# EAGLE design SPEAR Speedy (EAGLE 9.5.1)
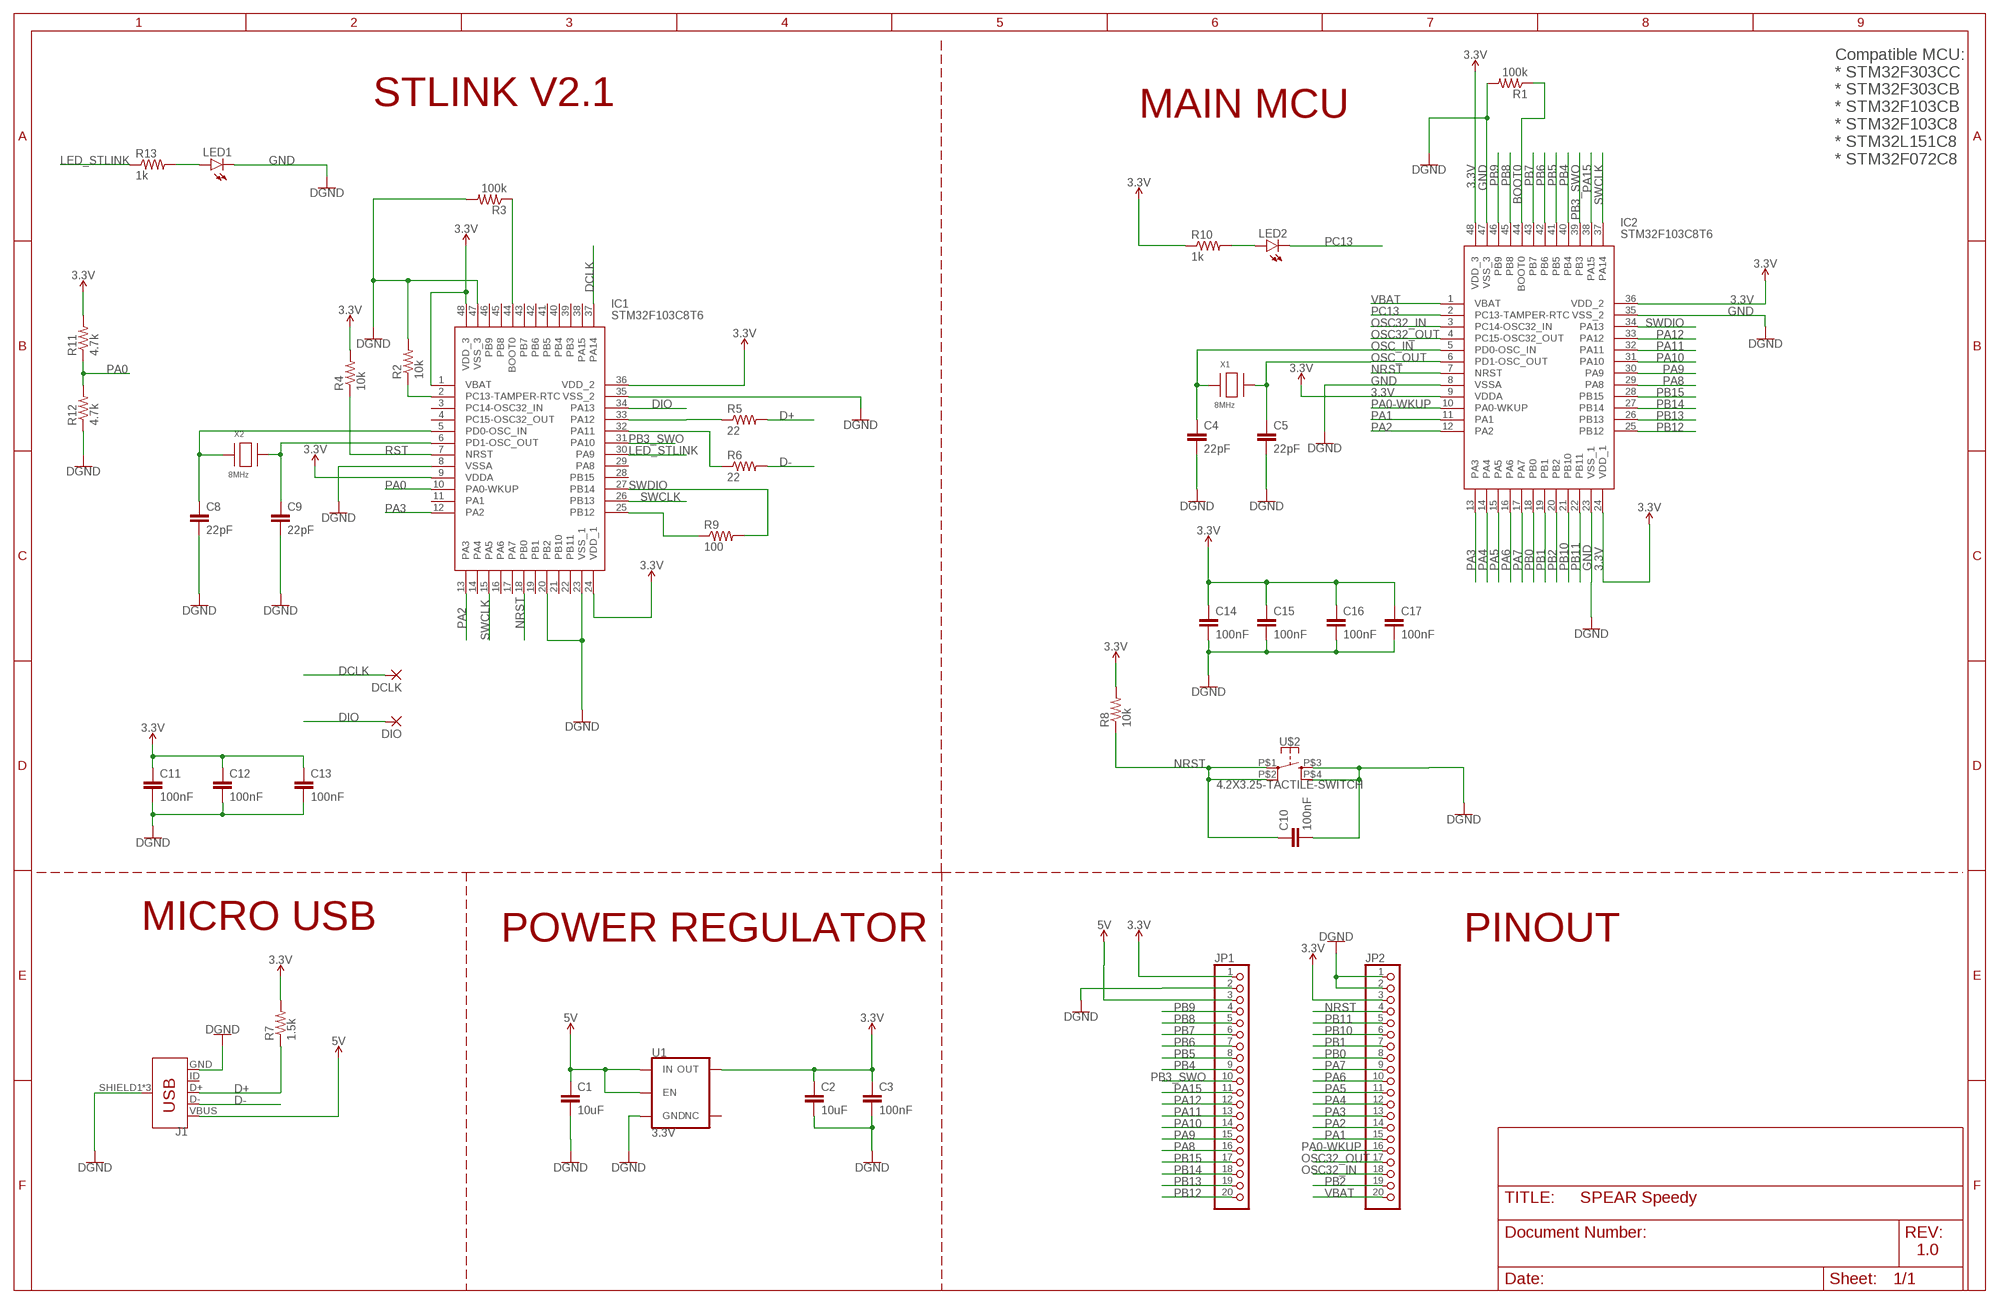
[diagram p0: schematic, sheet 1]

## Parts
C1  10uF  C-EUC0805  [C0805]
C2  10uF  C-EUC0805  [C0805]
C3  100nF  C-EUC0603  [C0603]
C4  22pF  C-EUC0603  [C0603]
C5  22pF  C-EUC0603  [C0603]
C8  22pF  C-EUC0603  [C0603]
C9  22pF  C-EUC0603  [C0603]
C10  100nF  C-EUC0603  [C0603]
C11  100nF  C-EUC0603  [C0603]
C12  100nF  C-EUC0603  [C0603]
C13  100nF  C-EUC0603  [C0603]
C14  100nF  C-EUC0603  [C0603]
C15  100nF  C-EUC0603  [C0603]
C16  100nF  C-EUC0603  [C0603]
C17  100nF  C-EUC0603  [C0603]
DCLK  SMD2  [SMD1,27-2,54]
DIO  SMD2  [SMD1,27-2,54]
IC1  STM32F103C8T6  [QFP50P900X900X160-48N]
IC2  STM32F103C8T6  [QFP50P900X900X160-48N]
J1  USB_MICRO-B_FEMALE-SMT  [USB-B-MICRO-SMD]
JP1  PINHD-1X20  [1X20]
JP2  PINHD-1X20  [1X20]
LED1  LEDCHIP-LED0805  [CHIP-LED0805]
LED2  LEDCHIP-LED0805  [CHIP-LED0805]
R1  100k  R-US_R0603  [R0603]
R2  10k  R-US_R0603  [R0603]
R3  100k  R-US_R0603  [R0603]
R4  10k  R-US_R0603  [R0603]
R5  22  R-US_R0603  [R0603]
R6  22  R-US_R0603  [R0603]
R7  1.5k  R-US_R0603  [R0603]
R8  10k  R-US_R0603  [R0603]
R9  100  R-US_R0603  [R0603]
R10  1k  R-US_R0603  [R0603]
R11  4.7k  R-US_R0603  [R0603]
R12  4.7k  R-US_R0603  [R0603]
R13  1k  R-US_R0603  [R0603]
U1  3.3V  V_REG_AP2112K-3.3V  [SOT23-5]
U$2  4.2X3.25-TACTILE-SWITCH  [4.2X3.25]
X1  8MHz  XTALNX5032  [NX5032]
X2  8MHz  XTALNX5032  [NX5032]

## Nets
3.3V: C2.1 C3.1 C11.1 C12.1 C13.1 C14.1 C15.1 C16.1 C17.1 IC1.1(VBAT) IC1.9(VDDA) IC1.24(VDD_1) IC1.36(VDD_2) IC1.48(VDD_3) IC2.9(VDDA) IC2.24(VDD_1) IC2.36(VDD_2) IC2.48(VDD_3) JP1.1 JP2.3 R4.2 R7.2 R8.2 R10.1 R11.2 U1.5(OUT)
5V: C1.1 J1.VBUS JP1.3 U1.1(IN) U1.3(EN)
BOOT0: IC2.44(BOOT0) R1.1
D+: J1.D+ R5.2 R7.1
D-: J1.D- R6.2
DCLK: DCLK.1(P) IC1.37(PA14)
DIO: DIO.1(P) IC1.34(PA13)
GND: C1.2 C2.2 C3.2 C4.2 C5.2 C8.2 C9.2 C10.2 C11.2 C12.2 C13.2 C14.2 C15.2 C16.2 C17.2 IC1.8(VSSA) IC1.20(PB2) IC1.23(VSS_1) IC1.35(VSS_2) IC1.47(VSS_3) IC2.8(VSSA) IC2.23(VSS_1) IC2.35(VSS_2) IC2.47(VSS_3) J1.GND J1.SHIELD1(SHIELD) J1.SHIELD2(SHIELD) J1.SHIELD3(SHIELD) JP1.2 JP2.1 JP2.2 LED1.C R1.2 R2.2 R3.2 R12.1 U1.2(GND) U$2.P$3 U$2.P$4 ; supply symbol labelled DGND
LED_STLINK: IC1.30(PA9) R13.1
N$1: IC1.33(PA12) R5.1
N$2: IC1.32(PA11) R6.1
N$3: IC1.44(BOOT0) R3.1
N$4: C8.1 IC1.5(PD0-OSC_IN) X2.P$1
N$5: IC1.2(PC13-TAMPER-RTC) R2.1
N$6: C9.1 IC1.6(PD1-OSC_OUT) X2.P$2
N$7: LED1.A R13.2
N$8: IC1.25(PB12) R9.1
N$9: LED2.A R10.2
NRST: C10.1 IC1.18(PB0) IC2.7(NRST) JP2.4 R8.1 U$2.P$1 U$2.P$2
OSC32_IN: IC2.3(PC14-OSC32_IN) JP2.18
OSC32_OUT: IC2.4(PC15-OSC32_OUT) JP2.17
OSC_IN: C4.1 IC2.5(PD0-OSC_IN) X1.P$1
OSC_OUT: C5.1 IC2.6(PD1-OSC_OUT) X1.P$2
PA0: IC1.10(PA0-WKUP) R11.1 R12.2
PA0-WKUP: IC2.10(PA0-WKUP) JP2.16
PA1: IC2.11(PA1) JP2.15
PA2: IC1.13(PA3) IC2.12(PA2) JP2.14
PA3: IC1.12(PA2) IC2.13(PA3) JP2.13
PA4: IC2.14(PA4) JP2.12
PA5: IC2.15(PA5) JP2.11
PA6: IC2.16(PA6) JP2.10
PA7: IC2.17(PA7) JP2.9
PA8: IC2.29(PA8) JP1.16
PA9: IC2.30(PA9) JP1.15
PA10: IC2.31(PA10) JP1.14
PA11: IC2.32(PA11) JP1.13
PA12: IC2.33(PA12) JP1.12
PA15: IC2.38(PA15) JP1.11
PB0: IC2.18(PB0) JP2.8
PB1: IC2.19(PB1) JP2.7
PB2: IC2.20(PB2) JP2.19
PB3_SWO: IC1.31(PA10) IC2.39(PB3) JP1.10
PB4: IC2.40(PB4) JP1.9
PB5: IC2.41(PB5) JP1.8
PB6: IC2.42(PB6) JP1.7
PB7: IC2.43(PB7) JP1.6
PB8: IC2.45(PB8) JP1.5
PB9: IC2.46(PB9) JP1.4
PB10: IC2.21(PB10) JP2.6
PB11: IC2.22(PB11) JP2.5
PB12: IC2.25(PB12) JP1.20
PB13: IC2.26(PB13) JP1.19
PB14: IC2.27(PB14) JP1.18
PB15: IC2.28(PB15) JP1.17
PC13: IC2.2(PC13-TAMPER-RTC) LED2.C
RST: IC1.7(NRST) R4.1
SWCLK: IC1.15(PA5) IC1.26(PB13) IC2.37(PA14)
SWDIO: IC1.27(PB14) IC2.34(PA13) R9.2
VBAT: IC2.1(VBAT) JP2.20
Unconnected: IC1.3(PC14-OSC32_IN) IC1.4(PC15-OSC32_OUT) IC1.11(PA1) IC1.14(PA4) IC1.16(PA6) IC1.17(PA7) IC1.19(PB1) IC1.21(PB10) IC1.22(PB11) IC1.28(PB15) IC1.29(PA8) IC1.38(PA15) IC1.39(PB3) IC1.40(PB4) IC1.41(PB5) IC1.42(PB6) IC1.43(PB7) IC1.45(PB8) IC1.46(PB9) J1.ID U1.4(NC)

## Notes on the sheet
- STLINK V2.1 | MAIN MCU
- Compatible MCU:
  * STM32F303CC
  * STM32F303CB
  * STM32F103CB
  * STM32F103C8
  * STM32L151C8
  * STM32F072C8
- MICRO USB | POWER REGULATOR | PINOUT
- 1.0

## Library data of the parts
C1-C3 C10-C17 = rcl:C-EU: CAPACITOR, European symbol; SPICEPREFIX: C
C4 C5 C8 C9 = resistor:C-EU: CAPACITOR, European symbol
DCLK DIO = wirepad:SMD2: SMD PAD
IC1 IC2 = LCSC:STM32F103C8T6: STM32F103C8T6, 32 bit ARM Cortex M3 Microcontroller 72MHz 64kb Flash, 20kb RAM, USB I2C SPI 48-Pin LQFP Source: Datasheet <http://www.mouser.com/datasheet/2/389/stm32f103c8-956229.pdf>; DESCRIPTION: STM32F103C8T6, 32 bit ARM Cortex M3 Microcontroller 72MHz 64kb Flash, 20kb RAM, USB I2C SPI 48-Pin LQFP; HEIGHT: 1.6mm; MANUFACTURER_NAME: STMicroelectronics; MANUFACTURER_PART_NUMBER: STM32F103C8T6; MOUSER_PART_NUMBER: 511-STM32F103C8T6
J1 = SparkFun-Connectors:USB_MICRO-B: USB Type Micro-B Connector Male/female and PTH/SMT variants SparkFun Products: SparkFun microB USB Breakout <https://www.sparkfun.com/products/12035> SparkFun USB microB Plug Breakout <https://www.sparkfun.com/products/10031> SparkFun ESP8266 Thing <https://www.sparkfun.com/products/13231>; PROD_ID: CONN-11752
JP1 JP2 = pinhead:PINHD-1X20: PIN HEADER
LED1 LED2 = led:LED: LED OSRAM: - CHIPLED LG R971, LG N971, LY N971, LG Q971, LY Q971, LO R971, LY R971 LH N974, LH R974 LS Q976, LO Q976, LY Q976 LO Q996 - Hyper CHIPLED LW Q18S LB Q993, LB Q99A, LB R99A - SideLED LS A670, LO A670, LY A670, LG A670, LP A670 LB A673, LV A673, LT A673, LW A673 LH A674 LY A675 LS A676, LA A676, LO A676, LY A676, LW A676 LS A679, LY A679, LG A679 - Hyper Micro SIDELED® LS Y876, LA Y876, LO Y876, LY Y876 LT Y87S - SmartLED LW L88C, LW L88S LB L89C, LB L89S, LG L890 LS L89K, LO L89K, LY L89K LS L896, LA L896, LO L896, LY L896 - TOPLED LS T670, LO T670, LY T670, LG T670, LP T670 LSG T670, LSP T670, LSY T670, LOP T670, LYG T670 LG T671, LOG T671, LSG T671 LB T673, LV T673, LT T673, LW T673 LH T674 LS T676, LA T676, LO T676, LY T676, LB T676, LH T676, LSB T676, LW T676 LB T67C, LV T67C, LT T67C, LS T67K, LO T67K, LY T67K, LW E67C LS E67B, LA E67B, LO E67B, LY E67B, LB E67C, LV E67C, LT E67C LW T67C LS T679, LY T679, LG T679 LS T770, LO T770, LY T770, LG T770, LP T770 LB T773, LV T773, LT T773, LW T773 LH T774 LS E675, LA E675, LY E675, LS T675 LS T776, LA T776, LO T776, LY T776, LB T776 LHGB T686 LT T68C, LB T68C - Hyper Mini TOPLED® LB M676 - Mini TOPLED Santana® LG M470 LS M47K, LO M47K, LY M47K Source: http://www.osram.convergy.de LUXEON: - LUMILED® LXK2-PW12-R00, LXK2-PW12-S00, LXK2-PW14-U00, LXK2-PW14-V00 LXK2-PM12-R00, LXK2-PM12-S00, LXK2-PM14-U00 LXK2-PE12-Q00, LXK2-PE12-R00, LXK2-PE12-S00, LXK2-PE14-T00, LXK2-PE14-U00 LXK2-PB12-K00, LXK2-PB12-L00, LXK2-PB12-M00, LXK2-PB14-N00, LXK2-PB14-P00, LXK2-PB14-Q00 LXK2-PR12-L00, LXK2-PR12-M00, LXK2-PR14-Q00, LXK2-PR14-R00 LXK2-PD12-Q00, LXK2-PD12-R00, LXK2-PD12-S00 LXK2-PH12-R00, LXK2-PH12-S00 LXK2-PL12-P00, LXK2-PL12-Q00, LXK2-PL12-R00 Source: www.luxeon.com KINGBRIGHT: KA-3528ASYC Source: www.kingbright.com
R1-R4 R8-R13 = rcl:R-US_: RESISTOR, American symbol; SPICEPREFIX: R
R5-R7 = resistor:R-US_: RESISTOR, American symbol
U1 = SparkFun-IC-Power:V_REG_AP2112: AP2112 - 600mA CMOS LDO Regulator w/ Enable The AP2112 is CMOS process low dropout linear regulator with enable function, the regulator delivers a guaranteed 600mA (min.) continuous load current. Features Output Voltage Accuracy: ±1.5% Output Current: 600mA (Min.) Foldback Short Current Protection: 50mA Enable Function to Turn ON/OFF VOUT Low Dropout Voltage (3.3V): 250mV (Typ.) @IOUT=600mA Excellent Load Regulation: 0.2%/A (Typ.) Excellent Line Regulation: 0.02%/V (Typ.) Low Quiescent Current: 55μA (Typ.) Low Standby Current: 0.01μA (Typ.) Low Output Noise: 50μVRMS PSRR: 100Hz -65dB, 1kHz -65dB OTSD Protection Stable with 1.0μF Flexible Cap: Ceramic, Tantalum and Aluminum Electrolytic Operation Temperature Range: -40°C to 85°C ESD: MM 400V, HBM 4000V; PROD_ID: VREG-12457
U$2 = LCSC:4.2X3.25-TACTILE-SWITCH
X1 X2 = adafruit:XTAL: Low cost SMT crystals, no capacitors included http://www.ladyada.net/library/eagle

## Board
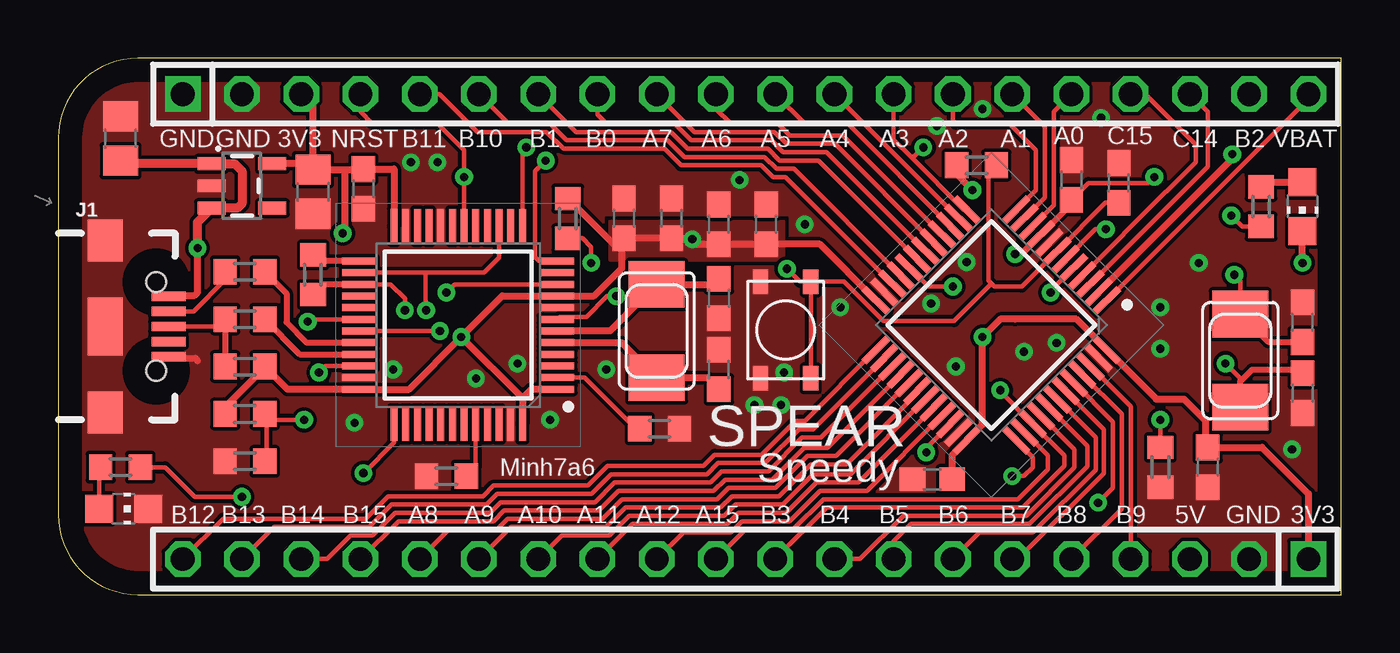
[diagram p1: board, top side]
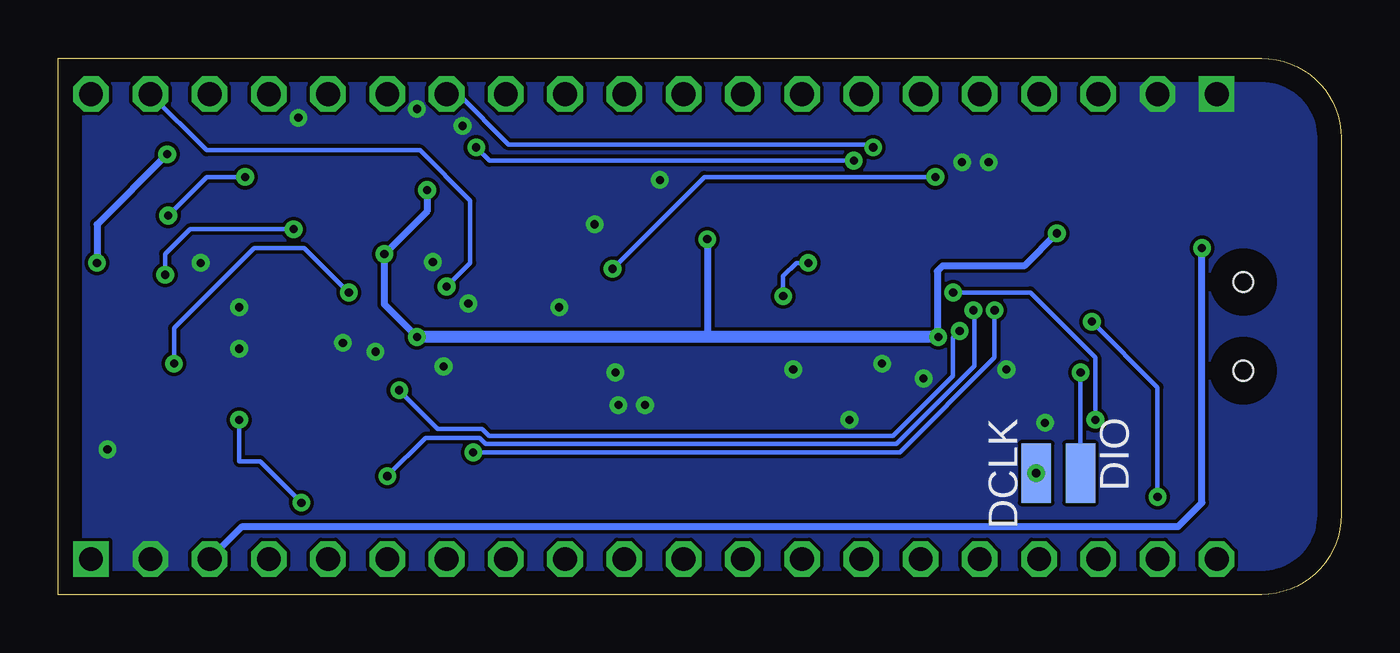
[diagram p2: board, bottom side, seen from below]

Size 55 x 23 mm. Coordinates in mm from the lower left corner, seen from the top.
Outline: 55,0 55,23 3.41,23 arc90 0,19.59 0,3.41 arc90 3.41,0 55,0
Copper layers (1*16): Top 0.035mm / dielectric 1.5mm / Bottom 0.035mm
Design rules "default *": minimum track width 6mil, minimum drill 0.35mm, track to track 6mil, track to pad 6mil, pad to pad 6mil, via to via 6mil, smd to smd 6mil, copper to edge 40mil, drill to drill 6mil, minimum pad ring 10mil, minimum via ring 8mil, stop-mask expansion 4mil, vias tented up to drill 30mil, thermal gap 10mil

### Footprints (pad centres in the part's own frame; a part is rotated, then mirrored left to right if it is on the bottom)
C0805 = smd 1.3 x 1.5: 1 -0.95,0; 2 0.95,0
C0603 = smd 1.1 x 1: 1 -0.85,0; 2 0.85,0
SMD1,27-2,54 = smd 1.27 x 2.54: 1 0,0
QFP50P900X900X160-48N = smd 1.475 x 0.3: 1 -4.238,2.75; 2 -4.238,2.25; 3 -4.238,1.75; 4 -4.238,1.25; 5 -4.238,0.75; 6 -4.238,0.25; 7 -4.238,-0.25; 8 -4.238,-0.75; 9 -4.238,-1.25; 10 -4.238,-1.75; 11 -4.238,-2.25; 12 -4.238,-2.75; 25 4.238,-2.75; 26 4.238,-2.25; 27 4.238,-1.75; 28 4.238,-1.25; 29 4.238,-0.75; 30 4.238,-0.25; 31 4.238,0.25; 32 4.238,0.75; 33 4.238,1.25; 34 4.238,1.75; 35 4.238,2.25; 36 4.238,2.75 | smd 0.3 x 1.475: 13 -2.75,-4.238; 14 -2.25,-4.238; 15 -1.75,-4.238; 16 -1.25,-4.238; 17 -0.75,-4.238; 18 -0.25,-4.238; 19 0.25,-4.238; 20 0.75,-4.238; 21 1.25,-4.238; 22 1.75,-4.238; 23 2.25,-4.238; 24 2.75,-4.238; 37 2.75,4.238; 38 2.25,4.238; 39 1.75,4.238; 40 1.25,4.238; 41 0.75,4.238; 42 0.25,4.238; 43 -0.25,4.238; 44 -0.75,4.238; 45 -1.25,4.238; 46 -1.75,4.238; 47 -2.25,4.238; 48 -2.75,4.238
USB-B-MICRO-SMD = smd 1.45 x 0.4: D+ 2.725,0; D- 2.725,0.65; GND 2.725,-1.3; ID 2.725,-0.65; VBUS 2.725,1.3 | smd 1.5 x 1.8: SHIELD1 0,3.685; SHIELD2 0,-3.685 | smd 1.5 x 2.5: SHIELD3 0,0 | hole 0.85: 2.2,1.9; 2.2,-1.9
1X20 = drill 1.016 square: 1 -24.13,0 | drill 1.016 octagon: 2 -21.59,0; 3 -19.05,0; 4 -16.51,0; 5 -13.97,0; 6 -11.43,0; 7 -8.89,0; 8 -6.35,0; 9 -3.81,0; 10 -1.27,0; 11 1.27,0; 12 3.81,0; 13 6.35,0; 14 8.89,0; 15 11.43,0; 16 13.97,0; 17 16.51,0; 18 19.05,0; 19 21.59,0; 20 24.13,0
CHIP-LED0805 = smd 1.2 x 1.2: A 0,-1.05; C 0,1.05
R0603 = smd 1 x 1.1: 1 -0.85,0; 2 0.85,0
SOT23-5 = smd 0.55 x 1.2: 1 -0.95,-1.3; 2 0,-1.3; 3 0.95,-1.3; 4 0.95,1.3; 5 -0.95,1.3
4.2X3.25 = smd 1.05 x 0.65: P$1 0,0; P$2 4.15,0; P$3 4.15,2.15; P$4 0,2.15
NX5032 = smd 2 x 2.4: P$1 2,0; P$2 -2,0

### Placement (x,y rotation side)
C1  2.67,19.56 90 top
C2  10.92,17.27 270 top
C3  30.35,15.88 90 top
C4  53.34,8.64 270 top
C5  53.34,11.68 90 top
C8  28.32,9.65 90 top
C9  28.32,12.7 270 top
C10  45.47,17.65 90 top
C11  24.26,16.13 90 top
C12  26.29,16.13 90 top
C13  37.47,4.95 180 top
C14  49.28,5.46 270 top
C15  28.32,15.88 90 top
C16  43.43,17.78 90 top
C17  13.08,17.4 270 top
DCLK  13.08,5.21 0 bottom
DIO  11.18,5.21 180 bottom
IC1  17.14,11.56 180 top
IC2  40.01,11.56 225 top
J1  2,11.5 0 top
JP1  29.46,1.52 180 top
JP2  29.46,21.46 0 top
LED1  2.79,3.68 270 top
LED2  53.34,16.64 180 top
R1  47.24,5.46 270 top
R2  25.78,7.11 0 top
R3  16.64,5.08 180 top
R4  21.84,16.13 90 top
R5  8,11.81 180 top
R6  8,13.84 180 top
R7  8,9.78 0 top
R8  39.37,18.41 180 top
R9  10.92,13.72 270 top
R10  51.56,16.64 90 top
R11  8,7.75 180 top
R12  8,5.71 0 top
R13  2.67,5.46 180 top
U1  7.87,17.53 270 top
U$2  32.26,9.27 90 top
X1  50.67,10.03 270 top
X2  25.65,11.3 270 top

### Tracks (layer width: path | path; a pad name or v marks a point on that pad's centre or on a via)
3.3V  (via drill 0.35)
  Top 0.203: v50.29,16.26 50.76,15.79 R10.1 | C16.1 44.16,17.65 46.74,17.65 v46.99,17.91
  Top 0.254: IC2.9 43.43,16.75 C16.1
  Top 0.305: 8.87,9.76 9.82,8.81 IC1.36 15.03,8.81 v17.27,11.05 | 8.87,9.76 R7.2 | R11.2 7.15,8.04 8.87,9.76 | IC2.24 32.65,15.03 C3.1 C15.1 27.18,15.03 27.18,15.15 | IC1.24 14.39,18.25 C17.1 13.05,18.22 12.28,18.22 | C2.1 12.28,18.22 | C2.1 10.67,18.48 U1.5 | C2.1 10.92,20.95 JP2.3 | v12.19,15.49 12.28,15.58 12.28,18.22 | v17.27,11.05 19.03,12.81 IC1.9 22.97,12.81 24.15,13.99 24.15,14.92 | v17.27,11.05 19.89,8.43 | 19.89,8.43 IC1.48 | 24.15,14.92 24.15,15.17 C11.1 C12.1 27.18,15.28 27.18,15.15 | C13.1 38.31,5.98 IC2.36 39.62,7.29 v39.62,11.05 40.39,11.81 41.02,11.81 43.64,11.81 IC2.48 47.07,8.38 48.26,8.38 49.17,7.47 49.17,6.42 C14.1 51.6,6.31 53.59,4.32 JP1.1 | IC1.1 20.28,8.81 19.89,8.43 | IC2.9 41.28,14.61 v41.02,14.61 | 27.18,15.15 v27.18,15.24 | R4.2 23.91,14.92 24.15,14.92 | R8.2 38.32,18.22 v39.19,17.35
  Bottom 0.203: v46.99,17.91 48.64,17.91 v50.29,16.26
  Bottom 0.305: v12.19,15.49 13.59,14.1 17.09,14.1 17.32,13.87 17.32,11.27 17.27,11.23 v17.27,11.05 | v39.62,11.05 41.02,12.45 v41.02,14.61 39.19,16.43 v39.19,17.35 | v27.18,15.24 27.18,11.05
  Bottom 0.508: v17.27,11.05 27.18,11.05 v39.62,11.05
  pour Top (no thermals): 23.62,16 23.62,14.35 31.11,14.35 31.11,16
5V  (via drill 0.35)
  Top 0.305: J1.VBUS 4.75,12.83 5.84,12.83 5.97,12.95 v5.97,14.86
  Top 0.381: v5.97,14.86 5.97,15.97 U1.3 7.69,16.58 7.87,16.76 7.87,18.16 7.56,18.48 U1.1 2.8,18.48 C1.1
  Bottom 0.305: JP1.3 47.12,2.92 6.99,2.92 5.97,3.94 v5.97,14.86
BOOT0  (via drill 0.35)
  Top 0.203: IC2.44 45.21,7.41 45.21,4.57 v44.58,3.94 | v47.24,7.49 R1.1
  Bottom 0.203: v44.58,3.94 46.35,5.71 47.24,5.71 v47.24,7.49
D+
  Top 0.203: J1.D+ 7.09,11.5 7.15,11.56
  Top 0.254: R5.2 7.15,11.56 R7.1
D-
  Top 0.203: J1.D- 5.8,12.15 7.15,13.5 R6.2
DCLK  (via drill 0.35)
  Top 0.203: IC1.37 14.39,6.52 DCLK.1
  other vias: 13.08,5.21
DIO  (via drill 0.35)
  Top 0.203: v11.17,9.53 11.46,9.81 IC1.34
  Bottom 0.203: DIO.1 v11.18,9.52 v11.17,9.53
GND  (via drill 0.35)
  Top 0.305: J1.GND 5.87,10.13 5.97,10.03
  other vias: 41.4,10.41 48.9,14.22 44.7,20.45 29.21,17.78 14.35,9.65 19.68,9.91 17.91,9.27 39.62,20.83 38.95,14.26 37.42,12.48 37.67,20.1 52.9,6.22 38.48,9.78 29.84,8.13 30.99,8.13 42.8,10.79 33.53,12.32 15.11,18.54 16.26,18.54 32,15.88 47.24,12.32 47.24,10.54 31.11,9.53 23.5,9.65 21.08,7.49 12.7,7.37
  pour Bottom (no thermals): -0.13,22.99 -0.13,0 54.99,0 54.99,22.99
  pour Top (rank 6, no thermals): -0.13,22.99 -0.13,0 54.99,0 54.99,22.99
LED_STLINK  (via drill 0.35)
  Top 0.203: R13.1 4.57,5.46 5.84,4.19 v7.87,4.19 | IC1.30 10.79,11.81 v10.69,11.7
  Bottom 0.203: v7.87,4.19 7.87,8.89 v10.69,11.7
N$1
  Top 0.254: R5.1 10.36,10.31 IC1.33
N$2
  Top 0.254: R6.1 9.78,12.91 9.78,11.68 10.66,10.81 IC1.32
N$3
  Top 0.203: IC1.44 17.89,5.49 R3.1
N$4
  Top 0.305: C8.1 27.82,9.3 X2.P$1 24.15,10.81 IC1.5
N$5
  Top 0.203: IC1.2 22.57,9.31 24.77,7.11 R2.1
N$6
  Top 0.305: C9.1 28.07,13.3 X2.P$2 23.66,11.31 IC1.6
N$7
  Top 0.203: LED1.A 1.74,5.39 R13.2
N$8
  Top 0.254: IC1.25 11.18,14.31 R9.1
N$9
  Top 0.305: R10.2 51.76,17.69 LED2.A
NRST  (via drill 0.35)
  Top 0.203: IC1.18 v17.39,17.91 17.39,19.05 16.26,20.19 13.46,20.19 12.95,20.7 JP2.4 | R8.1 39.88,18.07 39.88,13.46 40.01,13.34 | 40.01,13.34 40.13,13.21 41.3,13.21 IC2.7 44.9,16.8 C10.1 | U$2.P$2 33.68,13.42 35.37,11.73 38.4,11.73 40.01,13.34 | U$2.P$1 U$2.P$2 | U$2.P$2 31.79,13.42 v31.24,13.97
  Bottom 0.203: v31.24,13.97 27.3,17.91 v17.39,17.91
OSC32_IN
  Top 0.203: JP2.18 49.28,20.7 49.28,18.35 IC2.3
OSC32_OUT
  Top 0.203: JP2.17 46.61,21.46 48.77,19.3 48.77,18.54 47.51,17.27 47.49,17.27 IC2.4
OSC_IN  (via drill 0.35)
  Top 0.203: IC2.5 42.55,13.04 v42.55,12.95 | v50.04,9.91 50.67,9.27 50.67,8.13
  Top 0.254: X1.P$1 50.67,8.13 50.67,9.14 51.18,9.65 53.17,9.65 C4.1
  Bottom 0.203: v42.55,12.95 44.45,14.86 46.61,14.86 50.04,11.43 v50.04,9.91
OSC_OUT  (via drill 0.35)
  Top 0.203: IC2.6 44.47,15.67 v44.91,15.67 | v50.42,13.72 50.67,13.46 X1.P$2
  Top 0.254: X1.P$2 51.87,10.83 C5.1
  Bottom 0.203: v44.91,15.67 49.36,15.67 50.42,14.61 v50.42,13.72
PA0  (via drill 0.35)
  Top 0.203: IC1.10 16.99,13.31 v16.64,12.95 | v10.54,7.49 9.11,7.49 8.93,7.66 | 8.93,7.66 R11.1 | R12.2 8.93,5.8 8.93,7.66
  Bottom 0.203: v16.64,12.95 13.34,12.95 10.54,10.16 v10.54,7.49
PA0-WKUP
  Top 0.203: JP2.16 42.67,20.7 42.67,16.7 IC2.10
PA1
  Top 0.203: IC2.11 42.29,17.02 42.29,20.07 JP2.15
PA2  (via drill 0.35)
  Top 0.203: IC2.12 41.91,17.35 41.91,19.05 40.77,20.19 38.48,20.19 38.35,20.32 JP2.14 | IC1.13 19.89,19.01 v20.07,19.18
  Bottom 0.203: v20.07,19.18 20.19,19.3 35.69,19.3 37.85,21.46 JP2.14
PA3  (via drill 0.35)
  Top 0.203: IC2.13 38.83,16.5 36.55,18.77 | 36.55,18.77 35.81,19.51 JP2.13 | IC1.12 20.62,14.31 20.45,14.48 20.45,18.16 v20.89,18.61 | v37.08,19.18 36.68,18.77 | 36.68,18.77 | 36.68,18.77 36.55,18.77
  Bottom 0.203: v20.89,18.61 36.52,18.61 v37.08,19.18
PA4
  Top 0.203: IC2.14 JP2.12
PA5
  Top 0.203: IC2.15 33.84,20.19 32,20.19 JP2.11
PA6
  Top 0.203: IC2.16 33.65,19.68 31.62,19.68 31.37,19.68 30.86,20.19 28.83,20.19 28.19,20.83 JP2.10
PA7
  Top 0.203: IC2.17 33.29,19.33 31.22,19.33 30.71,19.84 27.28,19.84 JP2.9
PA8
  Top 0.203: IC2.29 33.33,5.94 32.11,5.94 30.74,4.57 28.73,4.57 28.25,4.09 24.17,4.09 23.33,3.25 19.26,3.25 18.8,2.79 16.76,2.79 JP1.16
PA9
  Top 0.203: JP1.15 19.41,2.9 23.48,2.9 24.32,3.73 28.39,3.73 28.88,4.22 30.89,4.22 32.26,5.59 33.78,5.59 36.83,8.64 IC2.30
PA10
  Top 0.203: IC2.31 33.96,5.16 32.35,5.16 31.06,3.86 29.02,3.86 28.54,3.38 24.46,3.38 23.63,2.54 21.59,2.54 JP1.14
PA11
  Top 0.203: JP1.13 24.61,3.02 28.69,3.02 29.17,3.5 31.21,3.5 32.5,4.8 34.31,4.8 IC2.32
PA12
  Top 0.203: IC2.33 34.66,4.45 32.65,4.45 31.35,3.15 29.32,3.15 28.83,2.67 26.8,2.67 JP1.12
PA15
  Top 0.203: IC2.38 42.42,5.96 42.42,5.36 41.15,4.09 32.8,4.09 31.5,2.79 29.46,2.79 JP1.11
PB0
  Top 0.203: IC2.18 32.94,18.97 31.07,18.97 30.57,19.48 27.13,19.48 26.42,20.19 23.5,20.19 23.11,20.57 JP2.8
PB1
  Top 0.203: JP2.7 22.2,19.84 26.27,19.84 26.98,19.13 30.42,19.13 30.93,18.62 32.59,18.62 IC2.19
PB2  (via drill 0.35)
  Top 0.203: IC2.20 37.29,13.21 v38.35,13.21
  Bottom 0.203: v38.35,13.21 37.34,14.22 37.34,16.89 39.5,19.05 48.64,19.05 JP2.19
PB3_SWO  (via drill 0.35)
  Top 0.203: JP1.10 32.94,3.73 41.35,3.73 43.13,5.51 43.13,5.96 IC2.39 40.39,8.7 v40.39,8.76 | IC1.31 v16.35,11.31 v16.36,11.3
  Bottom 0.203: v16.36,11.3 16.64,11.02 16.64,9.38 19.22,6.81 36.52,6.81 36.83,7.11 38.73,7.11 v40.39,8.76
PB4
  Top 0.203: IC2.40 43.56,6.23 43.56,5.45 41.49,3.38 36.23,3.38 34.38,1.52 JP1.9
PB5
  Top 0.203: JP1.8 35.81,2.29 36.55,3.02 41.64,3.02 44.12,5.5 44.12,6.38 IC2.41
PB6
  Top 0.203: IC2.42 44.48,6.73 44.48,5.35 41.79,2.67 39.5,2.67 JP1.7
PB7
  Top 0.203: IC2.43 44.83,7.08 44.83,5.21 41.15,1.52 JP1.6
PB8
  Top 0.203: IC2.45 45.59,7.74 45.59,3.68 JP1.5
PB9
  Top 0.203: IC2.46 45.97,8.06 JP1.4
PB10
  Top 0.203: IC2.21 31.53,18.26 30.78,18.26 30.27,18.77 26.84,18.77 26.13,19.48 21.8,19.48 21.09,20.19 19.3,20.19 JP2.6
PB11
  Top 0.203: JP2.5 16.34,21.46 17.97,19.84 20.94,19.84 21.65,19.13 25.98,19.13 26.69,18.41 30.12,18.41 30.63,17.91 31.18,17.91 IC2.22
PB12
  Top 0.203: JP1.20 7.06,3.25 13.17,3.25 14.14,4.22 18.21,4.22 18.67,4.67 22.72,4.67 23.56,5.51 27.66,5.51 28.14,5.99 30.15,5.99 31.6,7.44 32,7.44 IC2.25
PB13
  Top 0.203: JP1.19 9.25,2.9 13.32,2.9 14.29,3.86 18.36,3.86 18.82,4.32 22.86,4.32 23.7,5.16 27.8,5.16 28.29,5.64 30.3,5.64 31.75,7.09 32.35,7.09 IC2.26
PB14
  Top 0.203: IC2.27 32.7,6.73 31.89,6.73 30.45,5.28 28.43,5.28 27.95,4.8 23.85,4.8 23.01,3.96 18.96,3.96 18.51,3.5 14.43,3.5 13.47,2.54 12.53,2.54 11.52,1.52 JP1.18
PB15
  Top 0.203: JP1.17 14.58,3.15 18.65,3.15 19.11,3.61 23.18,3.61 24.02,4.45 28.1,4.45 28.58,4.93 30.59,4.93 31.96,6.3 32.98,6.3 IC2.28
PC13  (via drill 0.35)
  Top 0.305: v53.34,14.22 LED2.C | IC2.2 50.33,18.7 v50.33,18.89
  Bottom 0.305: v50.33,18.89 53.34,15.88 v53.34,14.22
RST  (via drill 0.35)
  Top 0.203: IC1.7 21.48,11.9 22.64,11.9 23.53,12.8 v23.92,12.8 | R4.1 22.48,15.28 22.84,14.91 v22.84,14.22
  Bottom 0.203: v23.92,12.8 23.92,13.65 23.35,14.22 v22.84,14.22
SWCLK  (via drill 0.35)
  Top 0.203: IC1.15 18.89,14.45 18.25,13.81 15.75,13.81 | IC2.37 41.78,5.89 41.78,5.46 41.4,5.08 v40.89,5.08 | IC1.26 15.75,13.81 | v15.77,12.19 15.75,12.21 15.75,13.81
  Bottom 0.203: v40.89,5.08 39.25,6.73 36.95,6.73 36.67,6.45 19.07,6.45 15.72,9.8 15.72,12.15 v15.77,12.19
SWDIO  (via drill 0.35)
  Top 0.203: IC1.27 14.25,13.31 14.86,12.7 v14.86,12.19 | v37.21,6.1 37.21,6.29 IC2.34
  Top 0.254: IC1.27 11.36,13.31 R9.2
  Bottom 0.203: v14.86,12.19 14.86,10.16 18.92,6.1 v37.21,6.1
VBAT
  Top 0.203: IC2.1 53.59,21.26 JP2.20

### Text on the board
tPlace: GND | GND | 3V3 | NRST | B11 | B10 | A2 | A1 | A0 | C15 | C14 | B2 | VBAT | B12 | B13 | B14 | B15 | A8 | A9 | A10 | A11 | A12 | A15 | B3 | B4 | B5 | B6 | B7 | B8 | B9 | 5V | 3V3
tNames: B1 | B0 | A7 | A6 | A5 | A4 | A3 | SPEAR | Minh7a6 | Speedy | GND